# EAGLE design Adafruit TFP401 to 40pin TFT (EAGLE 7.7.0)
COMPANY: ADAFRUIT INDUSTRIES; DRAWN: FZHAO; REV: C
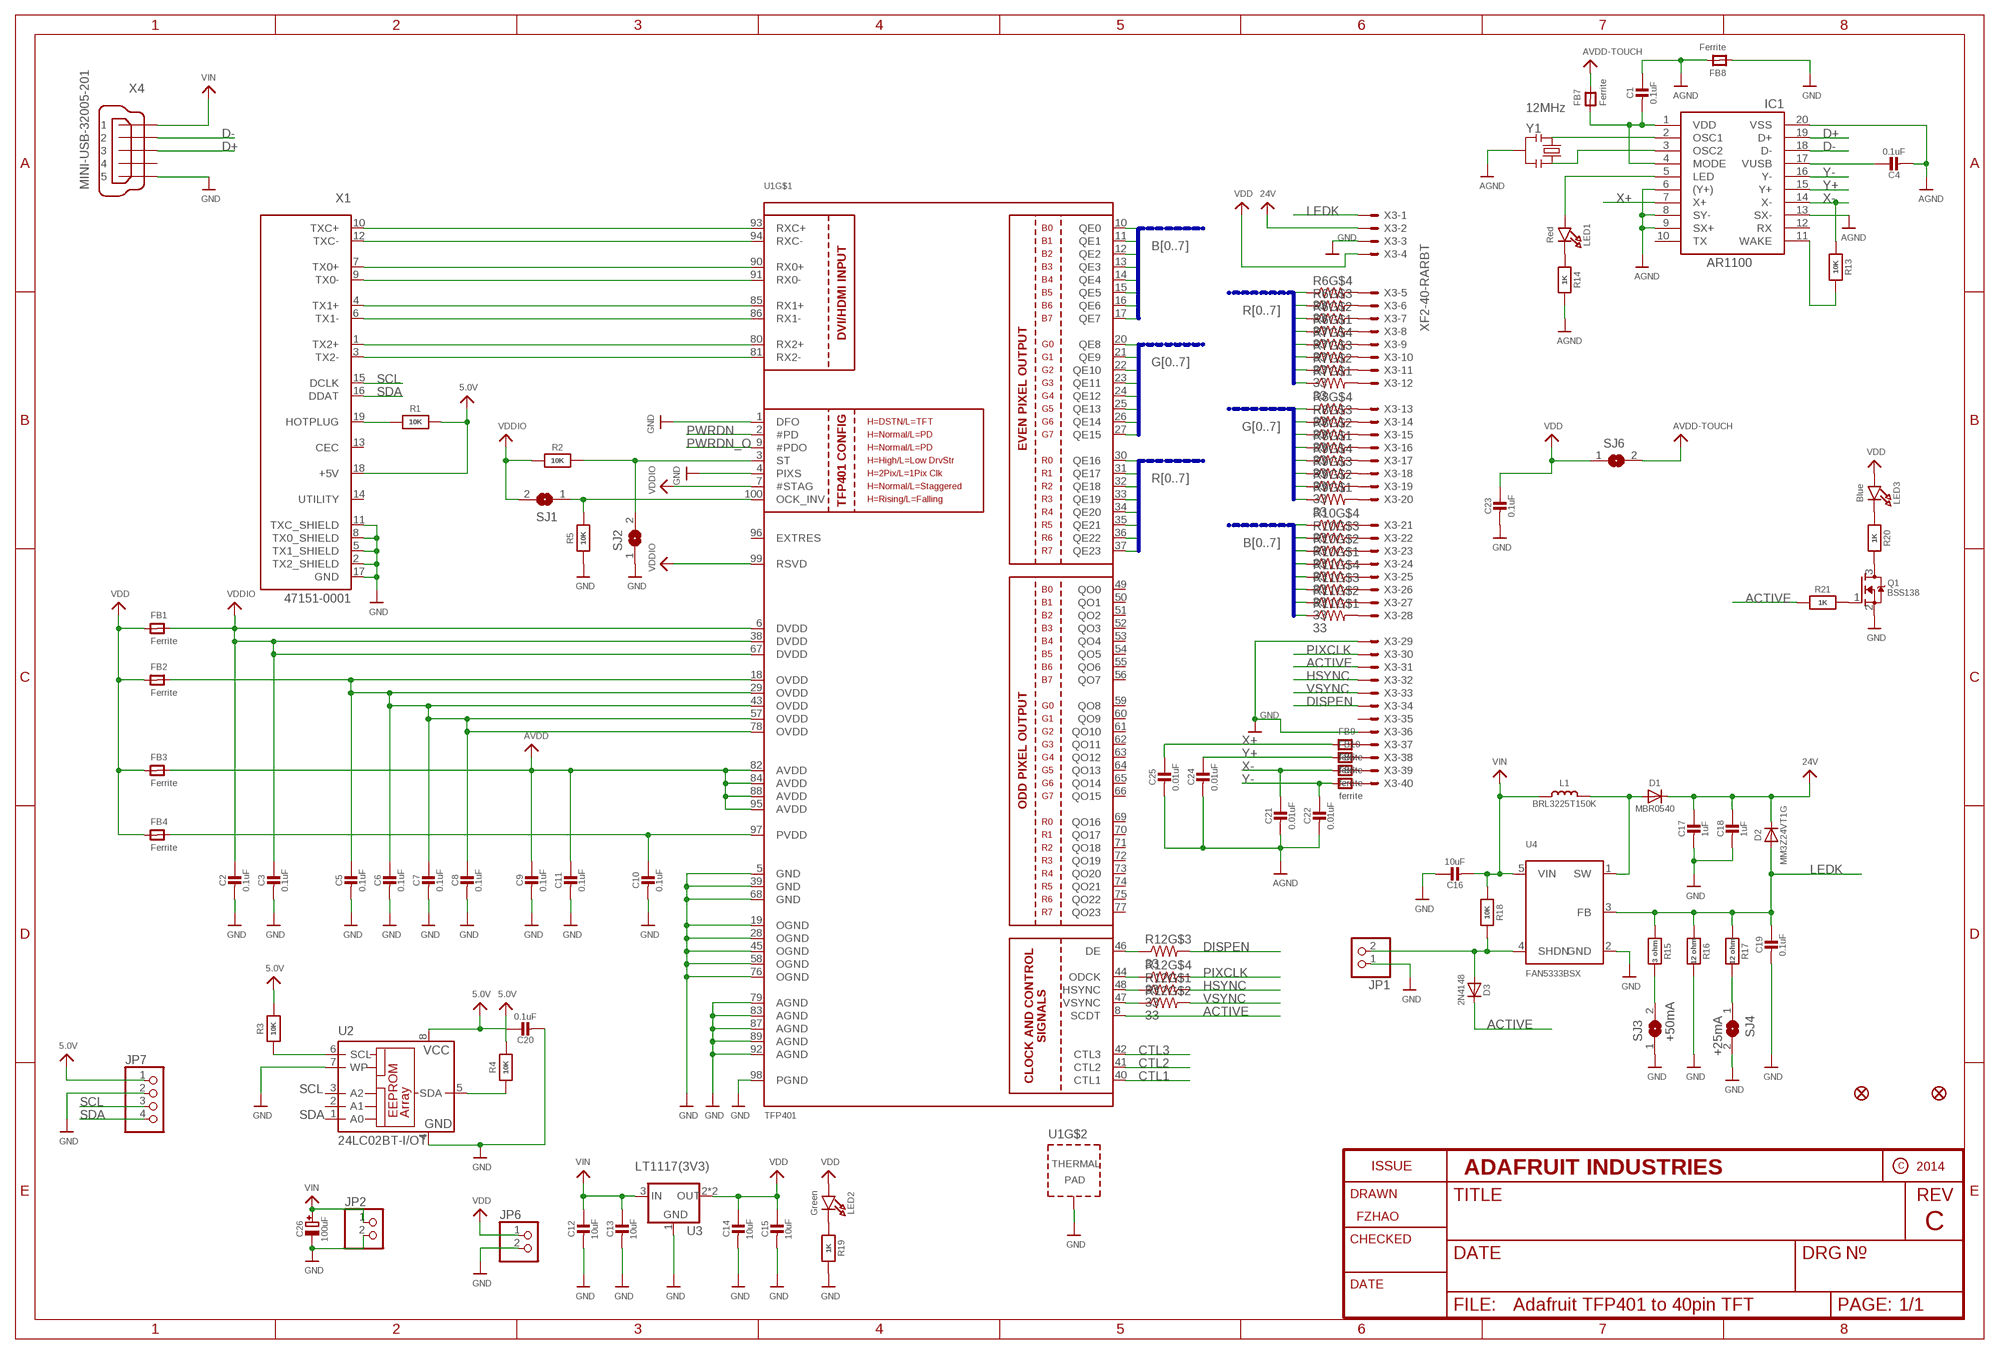
[diagram p0: schematic, sheet 1]

## Parts
C1  0.1uF  CAP_CERAMIC0805-NOOUTLINE  [0805-NO]
C2  0.1uF  CAP_CERAMIC0805-NOOUTLINE  [0805-NO]
C3  0.1uF  CAP_CERAMIC0805-NOOUTLINE  [0805-NO]
C4  0.1uF  CAP_CERAMIC0805-NOOUTLINE  [0805-NO]
C5  0.1uF  CAP_CERAMIC0805-NOOUTLINE  [0805-NO]
C6  0.1uF  CAP_CERAMIC_0805MP  [_0805MP]
C7  0.1uF  CAP_CERAMIC0805-NOOUTLINE  [0805-NO]
C8  0.1uF  CAP_CERAMIC0805-NOOUTLINE  [0805-NO]
C9  0.1uF  CAP_CERAMIC0805-NOOUTLINE  [0805-NO]
C10  0.1uF  CAP_CERAMIC0805-NOOUTLINE  [0805-NO]
C11  0.1uF  CAP_CERAMIC0805-NOOUTLINE  [0805-NO]
C12  10uF  CAP_CERAMIC0805-NOOUTLINE  [0805-NO]
C13  10uF  CAP_CERAMIC0805-NOOUTLINE  [0805-NO]
C14  10uF  CAP_CERAMIC0805-NOOUTLINE  [0805-NO]
C15  10uF  CAP_CERAMIC0805-NOOUTLINE  [0805-NO]
C16  10uF  CAP_CERAMIC0805-NOOUTLINE  [0805-NO]
C17  1uF  CAP_CERAMIC0805-NOOUTLINE  [0805-NO]
C18  1uF  CAP_CERAMIC0805-NOOUTLINE  [0805-NO]
C19  0.1uF  CAP_CERAMIC0805-NOOUTLINE  [0805-NO]
C20  0.1uF  CAP_CERAMIC0805-NOOUTLINE  [0805-NO]
C21  0.01uF  CAP_CERAMIC0805-NOOUTLINE  [0805-NO]
C22  0.01uF  CAP_CERAMIC0805-NOOUTLINE  [0805-NO]
C23  0.1uF  CAP_CERAMIC0805-NOOUTLINE  [0805-NO]
C24  0.01uF  CAP_CERAMIC0805-NOOUTLINE  [0805-NO]
C25  0.01uF  CAP_CERAMIC0805-NOOUTLINE  [0805-NO]
C26  100uF  CAP_ELECTROLYTICPANASONIC_C  [PANASONIC_C]
D1  MBR0540  DIODESOD-123  [SOD-123]
D2  MM3Z24VT1G  DIODESMA  [SMADIODE]
D3  2N4148  DIODESOD-323  [SOD-323]
FB1  Ferrite  FERRITE_0805MP  [_0805MP]
FB2  Ferrite  FERRITE_0805MP  [_0805MP]
FB3  Ferrite  FERRITE_0805MP  [_0805MP]
FB4  Ferrite  FERRITE_0805MP  [_0805MP]
FB5  ferrite  FERRITE_0805MP  [_0805MP]
FB6  ferrite  FERRITE_0805MP  [_0805MP]
FB7  Ferrite  FERRITE_0805MP  [_0805MP]
FB8  Ferrite  FERRITE_0805MP  [_0805MP]
FB9  ferrite  FERRITE_0805MP  [_0805MP]
FB10  ferrite  FERRITE_0805MP  [_0805MP]
FID1  FIDUCIAL""  [FIDUCIAL_1MM]
FID3  FIDUCIAL""  [FIDUCIAL_1MM]
IC1  AR1100_SSOP  [TSSOP20-5.3MMBODY]
JP1  HEADER-1X2ROUND  [1X02_ROUND]
JP2  HEADER-1X2ROUND  [1X02_ROUND]
JP6  HEADER-1X2ROUND  [1X02_ROUND]
JP7  HEADER-1X476MIL  [1X04_ROUND_76]
L1  BRL3225T150K  INDUCTORNR5040  [INDUCTOR_5X5MM_NR5040_NOTHERMALS]
LED1  Red  LED0805_NOOUTLINE  [CHIPLED_0805_NOOUTLINE]
LED2  Green  LED0805_NOOUTLINE  [CHIPLED_0805_NOOUTLINE]
LED3  Blue  LED0805_NOOUTLINE  [CHIPLED_0805_NOOUTLINE]
Q1  BSS138  MOSFET-NREFLOW  [SOT23-R]
R1  10K  RESISTOR0805_NOOUTLINE  [0805-NO]
R2  10K  RESISTOR0805_NOOUTLINE  [0805-NO]
R3  10K  RESISTOR0805_NOOUTLINE  [0805-NO]
R4  10K  RESISTOR0805_NOOUTLINE  [0805-NO]
R5  10K  RESISTOR_0805MP  [_0805MP]
R6  33  RESISTOR_4PACK_US  [RESPACK_4X0603]
R7  33  RESISTOR_4PACK_US  [RESPACK_4X0603]
R8  33  RESISTOR_4PACK_US  [RESPACK_4X0603]
R9  33  RESISTOR_4PACK_US  [RESPACK_4X0603]
R10  33  RESISTOR_4PACK_US  [RESPACK_4X0603]
R11  33  RESISTOR_4PACK_US  [RESPACK_4X0603]
R12  33  RESISTOR_4PACK_US  [RESPACK_4X0603]
R13  10K  RESISTOR_0805MP  [_0805MP]
R14  1K  RESISTOR0805_NOOUTLINE  [0805-NO]
R15  3 ohm  RESISTOR0805_NOOUTLINE  [0805-NO]
R16  12 ohm  RESISTOR0805_NOOUTLINE  [0805-NO]
R17  12 ohm  RESISTOR0805_NOOUTLINE  [0805-NO]
R18  10K  RESISTOR0805_NOOUTLINE  [0805-NO]
R19  1K  RESISTOR0805_NOOUTLINE  [0805-NO]
R20  1K  RESISTOR0805_NOOUTLINE  [0805-NO]
R21  1K  RESISTOR0805_NOOUTLINE  [0805-NO]
SJ1  SOLDERJUMPER  [SOLDERJUMPER_ARROW_NOPASTE]
SJ2  SOLDERJUMPER  [SOLDERJUMPER_ARROW_NOPASTE]
SJ3  +50mA  SOLDERJUMPER  [SOLDERJUMPER_ARROW_NOPASTE]
SJ4  +25mA  SOLDERJUMPER  [SOLDERJUMPER_ARROW_NOPASTE]
SJ6  SOLDERJUMPERCLOSED  [SOLDERJUMPER_CLOSEDWIRE]
U1  TFP401  [S-PQFP-G100]
U2  24LC02BT-I/OT  24C02ASM  [SO-08M]
U3  LT1117(3V3)  VREG_SOT223  [SOT223-R]
U4  FAN5333BSX  VREG_FAN5331  [SOT23-5]
X1  47151-0001  HDMI_MOLEX_47151DIM  [HDMI_MOLEX_47151-0001_DIMLAYER]
X3  XF2-40-RARBT  [4-1734839-0]
X4  MINI-USB-32005-201  [32005-201]
Y1  12MHz  RESONATORSMD  [RESONATOR-SMD]

## Nets
5.0V: C20.1 JP7.1 R1.2 R3.2 R4.2 U2.8(VCC) X1.18(+5V)
24V: C17.1 C18.1 D1.C D2.C X3.2
ACTIVE: D3.C R21.1 U1.8(SCDT) X3.31
AGND: C1.1 C4.2 C21.2 C22.2 C24.2 C25.2 FB8.2 IC1.6((Y+)) IC1.8(SY-) IC1.9(SX+) IC1.13(SX-) IC1.20(VSS) R14.2 Y1.2
ASD: R12.3 U1.46(DE)
AVDD: C9.1 C11.1 FB3.2 U1.82(AVDD) U1.84(AVDD) U1.88(AVDD) U1.95(AVDD)
AVDD2: FB7.2 SJ6.2 ; supply symbol labelled AVDD-TOUCH
B0: R10.4 U1.10(QE0)
B1: R10.3 U1.11(QE1)
B2: R10.2 U1.12(QE2)
B3: R10.1 U1.13(QE3)
B4: R11.4 U1.14(QE4)
B5: R11.3 U1.15(QE5)
B6: R11.2 U1.16(QE6)
B7: R11.1 U1.17(QE7)
CTL1: U1.40(CTL1)
CTL2: U1.41(CTL2)
CTL3: U1.42(CTL3)
CVB: R12.2 U1.47(VSYNC)
D+: IC1.19(D+) X4.3
D-: IC1.18(D-) X4.2
DISPEN: R12.6 X3.34
G0: R8.4 U1.20(QE8)
G1: R8.3 U1.21(QE9)
G2: R8.2 U1.22(QE10)
G3: R8.1 U1.23(QE11)
G4: R9.4 U1.24(QE12)
G5: R9.3 U1.25(QE13)
G6: R9.2 U1.26(QE14)
G7: R9.1 U1.27(QE15)
GND: C2.2 C3.2 C5.2 C6.2 C7.2 C8.2 C9.2 C10.2 C11.2 C12.2 C13.2 C14.2 C15.2 C16.1 C17.2 C18.2 C19.2 C20.2 C23.2 C26.- FB8.1 JP1.1 JP2.2 JP6.2 JP7.2 Q1.2(S) R5.1 R16.2 R19.2 SJ2.1 SJ3.1 SJ4.2 U1.1(DFO) U1.4(PIXS) U1.5(GND) U1.19(OGND) U1.28(OGND) U1.39(GND) U1.45(OGND) U1.58(OGND) U1.68(GND) U1.76(OGND) U1.79(AGND) U1.83(AGND) U1.87(AGND) U1.89(AGND) U1.92(AGND) U1.98(PGND) U1.P$1(TP) U1.P$2(TP) U1.P$3(TP) U1.P$4(TP) U1.P$5(TP) U1.P$6(TP) U1.P$7(TP) U1.P$8(TP) U1.P$9(TP) U1.P$10(TP) U1.P$11(TP) U1.P$12(TP) U1.P$13(TP) U1.P$14(TP) U1.P$15(TP) U1.P$16(TP) U1.THERMAL(TP) U2.4(GND) U2.7(WP) U3.1(GND) U4.2(GND) X1.2(TX2_SHIELD) X1.5(TX1_SHIELD) X1.8(TX0_SHIELD) X1.11(TXC_SHIELD) X1.17(GND) X3.3 X3.29 X3.36 X4.5
HSYNC: R12.8 X3.32
LEDK: C19.1 D2.A R15.1 R16.1 R17.1 U4.3(FB) X3.1
N$1: U1.93(RXC+) X1.10(TXC+)
N$2: U1.94(RXC-) X1.12(TXC-)
N$3: U1.90(RX0+) X1.7(TX0+)
N$4: U1.91(RX0-) X1.9(TX0-)
N$5: U1.85(RX1+) X1.4(TX1+)
N$6: U1.86(RX1-) X1.6(TX1-)
N$7: U1.80(RX2+) X1.1(TX2+)
N$8: U1.81(RX2-) X1.3(TX2-)
N$9: R1.1 X1.19(HOTPLUG)
N$10: IC1.2(OSC1) Y1.1
N$11: IC1.3(OSC2) Y1.3
N$12: C4.1 IC1.17(VUSB)
N$13: LED2.C R19.1
N$14: R6.5 X3.5
N$15: R6.6 X3.6
N$16: R6.7 X3.7
N$17: R6.8 X3.8
N$18: R7.5 X3.9
N$19: R7.6 X3.10
N$20: R7.7 X3.11
N$21: R7.8 X3.12
N$22: R8.5 X3.13
N$23: R8.6 X3.14
N$24: R8.7 X3.15
N$25: R8.8 X3.16
N$26: R9.5 X3.17
N$27: R9.6 X3.18
N$28: R9.7 X3.19
N$29: R9.8 X3.20
N$30: R10.5 X3.21
N$31: R10.6 X3.22
N$32: R10.7 X3.23
N$33: R10.8 X3.24
N$34: R11.5 X3.25
N$35: R11.6 X3.26
N$36: R11.7 X3.27
N$38: C10.1 FB4.2 U1.97(PVDD)
N$39: R11.8 X3.28
N$40: IC1.11(WAKE) R13.2
N$41: LED1.C R14.1
N$42: C5.1 C6.1 C7.1 C8.1 FB2.2 U1.18(OVDD) U1.29(OVDD) U1.43(OVDD) U1.57(OVDD) U1.78(OVDD)
N$43: IC1.5(LED) LED1.A
N$45: LED3.C R20.1
N$46: Q1.3(D) R20.2
N$47: D1.A L1.P$2 U4.1(SW)
N$48: Q1.1(G) R21.2
N$49: R15.2 SJ3.2
N$50: R17.2 SJ4.1
N$52: D3.A JP1.2 R18.2 U4.4(SHDN)
N$53: FB5.2 X3.39
N$54: FB6.2 X3.40
N$55: C1.2 FB7.1 IC1.1(VDD) IC1.4(MODE)
N$56: FB9.2 X3.37
N$57: FB10.2 X3.38
OCK_INV: R5.2 SJ1.1 U1.100(OCK_INV)
PIXCLK: R12.5 X3.30
PWRDN: U1.2(#PD)
PWRDN_O: U1.9(#PDO)
R0: R6.4 U1.30(QE16)
R1: R6.3 U1.31(QE17)
R2: R6.2 U1.32(QE18)
R3: R6.1 U1.33(QE19)
R4: R7.4 U1.34(QE20)
R5: R7.3 U1.35(QE21)
R6: R7.2 U1.36(QE22)
R7: R7.1 U1.37(QE23)
SCL: JP7.3 R3.1 U2.6(SCL) X1.15(DCLK)
SDA: JP7.4 R4.1 U2.5(SDA) X1.16(DDAT)
ST: R2.2 SJ2.2 U1.3(ST)
VDD: C14.1 C15.1 C23.1 FB1.1 FB2.1 FB3.1 FB4.1 JP6.1 LED2.A LED3.A SJ6.1 U3.2(OUT) U3.4(OUT) X3.4
VDDIO: C2.1 C3.1 FB1.2 R2.1 SJ1.2 U1.6(DVDD) U1.7(#STAG) U1.38(DVDD) U1.67(DVDD) U1.99(RSVD)
VIN: C12.1 C13.1 C16.2 C26.+ JP2.1 L1.P$1 R18.1 U3.3(IN) U4.5(VIN) X4.1
VSYNC: R12.7 X3.33
X+: C25.1 FB9.1 IC1.7(X+)
X-: C21.1 FB5.1 IC1.14(X-) R13.1
XCV: R12.1 U1.48(HSYNC)
Y+: C24.1 FB10.1 IC1.15(Y+)
Y-: C22.1 FB6.1 IC1.16(Y-)
ZXC: R12.4 U1.44(ODCK)
Unconnected: IC1.10(TX) IC1.12(RX) U1.49(QO0) U1.50(QO1) U1.51(QO2) U1.52(QO3) U1.53(QO4) U1.54(QO5) U1.55(QO6) U1.56(QO7) U1.59(QO8) U1.60(QO9) U1.61(QO10) U1.62(QO11) U1.63(QO12) U1.64(QO13) U1.65(QO14) U1.66(QO15) U1.69(QO16) U1.70(QO17) U1.71(QO18) U1.72(QO19) U1.73(QO20) U1.74(QO21) U1.75(QO22) U1.77(QO23) U1.96(EXTRES) U2.1(A0) U2.2(A1) U2.3(A2) X1.13(CEC) X1.14(UTILITY) X3.35 X4.4

## Buses
B[0..7]
G[0..7]
R[0..7]

## Power pins joined to a net without a drawn wire
GND: X1.P$1(GND) X1.P$2(GND) X1.P$3(GND) X1.P$4(GND)

## Library data of the parts
C1-C25 = microbuilder:CAP_CERAMIC: Ceramic Capacitors For new designs, use the packages preceded by an '_' character since they are more reliable: The following footprints should be used on most boards: _0402 - Standard footprint for regular board layouts _0603 - Standard footprint for regular board layouts _0805 - Standard footprint for regular board layouts _1206 - Standard footprint for regular board layouts For extremely tight-pitch boards where space is at a premium, the following 'micro-pitch' footprints can be used (smaller pads, no silkscreen outline, etc.): _0402MP - Micro-pitch footprint for very dense/compact boards _0603MP - Micro-pitch footprint for very dense/compact boards _0805MP - Micro-pitch footprint for very dense/compact boards _1206MP - Micro-pitch footprint for very dense/compact boards
C26 = microbuilder:CAP_ELECTROLYTIC: Electrolytic Capacitors SMT PANASONIC_C - Size C Panasonic Electrolytic Aluminum Capacitor 47µF 16V 20% Electrolytic Capacitor [Digikey: PCE3890TR-ND] PANASONIC_D - Size D Panasonic Electrolytic Aluminum Capacitor 100µF 25V 20% Electrolytic Capacitor [Digikey: PCE3898TR-ND] PTH 3.5 mm grid, 8 mm diameter ... 3.5 mm grid, 10 mm diameter ...
D1-D3 = microbuilder:DIODE: Diode SMA Model Volts Amps Type Vf Ir Digikey # Notes SSA34-E3 40V 3A Schottky 480mV @ 3A 200uA @ 40V SSA34-E3/61TGITR-ND CDBA120-G 20V 1A Schottky 500mV @ 1A 500uA @ 20V 641-1014-6-ND REEL MBRA210 10V 2A Schottky 350mV @ 2A 700uA @ 10V MBRA210LT3 SOD-123 Model Volts Amps Type Vf Ir Order # Notes BAT54T1G 30V 200mA Schottky 800mV @ 200mA 2uA @ 25V BAT54T1GOSTR-ND B0530W 30V 500mA Schottky 430mV @ 500mA 130uA @ 30V B0530W-FDICT-ND REEL MBR120 20V 1A Schottky 340mV @ 1A MBR120VLSFT1GOSCT-ND SOD-323 Model Volts Amps Type Vf Ir Order # Notes PMEG2005EJ 20V 500mA Schottky 355mV @ 500mA 568-4110-1-ND ZLLS410 10V 570mA Schottky 380mV @ 570mA ZLLS410CT-ND 1N4148WS 75V 150mA Silicon/Simple 1V 1N4148WSFSCT-ND REEL SOD-523 Model Volts Amps Type Vf Ir Order # Notes BAT54XV2 30V 200mA Schottky 0.8V @ 100mA BAT54XV2CT-ND TB751S 30V 30mA Schottky RB751S-40TE61CT-ND SOT23-R/W (R = Solder Paste/Reflow Ovens, W = Hand-Soldering) Model Volts Amps Type Vf Ir Order # Notes BAT54FILM 40V 300mA Schottky 497-7162-1-ND POWERDI-5 Model Volts Amps Type Vf Ir Order # Notes PDS560 60V 5A Schottky 670mV @ 5A 150uA @ 60V PDS560DICT-ND
FB1-FB10 = microbuilder:FERRITE: Ferrite Bead 0603 MMZ1608B121C - 120 Ohm @ 100MHz, 600mA, 0.15 Ohm DC Resistance - Digikey: 445-2164-1-ND BK1608HW121-T - 120 Ohm, 600mA Ferrite Chip - Digikey: 587-1876-2-ND 0805 HZ0805B272R-10 - 2.7K Ohm @ 100MHz, 200mA, 0.8 Ohm DC Resistance - Digikey: 240-2504-1-ND (see also Murata BLM21BD272SN1L) MMZ2012Y152B - 1.5K Ohm @ 100MHz, 500mA, 0.4 Ohm DC Resistance - Digikey: 445-1560-1-ND - Mainly for high frequency (80-400MHz) MMZ2012R102A - 1K Ohm @ 100MHz, 500mA, 0.3 Ohm DC Resistance - Digikey: 445-1555-2-ND - More general purpose (10-200MHz)
FID1 FID3 = microbuilder:FIDUCIAL: Fiducial Alignment Points Various fiducial points for machine vision alignment.; BOM: EXCLUDE
IC1 = microbuilder:AR1100
JP1 JP2 JP6 = microbuilder:HEADER-1X2: PIN HEADER
JP7 = microbuilder:HEADER-1X4: PIN HEADER
L1 = microbuilder:INDUCTOR: Inductors 0603: 10nH Ceramic Inductor - microwire antenna/RF (Digikey: 712-1434-2-ND) 0805: 560nH Ceramic Inductor - RF (Digikey: 553-1047-1-ND) 270nH Ceramic Inductor - Q = 40@250MHz, +-5%, 1 Ohm DC Resistance (Digikey: 535-10506-2-ND) 1007 (2518 Metric) SMT: 10µH 10% 250mOhm 820mA 1007 Inductor (Digikey: 587-2189-1-ND) 22µH 10% 500mOhm 580mA 1007 Inductor (Digikey: 587-2190-1-ND) 47µH 10% 950mOhm 420mA 1007 Inductor (Digikey: 587-2191-1-ND) 47µH 5% 100mOhm 1A 1008 Inductor (Digikey: 732-1816-1-ND) 5.0x5.0mm (Taiyo Yuden NR5040 Series) 6.8µH 20% 2.3A 64mOhm Inductor (Digikey: 587-2374-2-ND) 5.0x5.0mm (TDK VLC5045 Series) 4.7µH 20% 3.3A 34mOhm Inductor (Digikey: 445-6526-1-ND) 6.8µH 20% 2.7A 46mOhm Inductor (Digikey: 445-6527-1-ND) 6.0x6.0mm (TDK VLC6045 Series) 4.7µH 20% 3.8A 27mOhm Inductor (Digikey: 445-6538-2-ND) 6.8µH 20% 3A 41mOhm Inductor (Digikey: 445-6540-1-ND) 6.2µH 30% 2.2A 45mOhm Inductor (Digikey: SRR5028-6R2YCT-ND) - Not TDK VLC6045 but footprint should match 6.0x6.0mm (TDK SLF6045 Series) 6.8uH 30% 2A 33mOhm Inductor (Digikey: 445-4572-1-ND, Mouser: 810-SLF645T6R8N2R0PF) 6.0x6.0mm (Sumida CDRH5D28 Series) 6.2uH 30% 1.8A 45mOhm Inductor (Digikey: 308-1542-1-ND) Taiyo Yuden NR3015T2R2M - 2.2uH 20% 1.5A (Digikey: 587-1648-2-ND, Mouser: 963-NR3015T2R2M) - Used with TI TPS62172 CoilCraft RFID Transponder Coil - MA5532-AE (For use with AS3935 Lightning Sensor) Vishay IHLP 1.0uH Molded Inductor - 24mOhm DCR, 5A, +/-20%, -55°C-125°C (Digikey: 541-1319-1-ND)
LED1-LED3 = microbuilder:LED: LED 0603 - 0603 Surface Mount Package 2mA: Green LED - Low Power (3.9mcd, 2ma, 1.7Vf) - Digikey: 475-2709-2-ND Orange LED - Low Power (9.8mcd, 2ma, 1.8Vf) - Digikey: 475-1194-2-ND Red LED - Low Power (5mcd, 2ma, 1.8Vf) - Digikey: 475-1195-2-ND Yellow LED - Low Power (7mcd, 2ma, 1.8Vf) - Digikey: 475-1196-2-ND 5mA: Blue LED - Low Power (17mcd, 5ma, 2.9Vf) - Digikey: LNJ937W8CRACT-ND 0805 - 0805 Surface Mount Package 2mA: Red LED (8.8mcd, 2mA, 1.8Vf, Clear) - Low Power [Digikey: 475-2510-1-ND] Green LED (5mcd, 2mA, 1.8Vf, Clear) - Low Power [Digikey: 475-2730-1-ND] Yellow LED (11.3mcd, 2mA, 1.8Vf, Clear) - Low Power [Digikey: 475-2555-1-ND] 20mA: Red LED (104mcd, 20mA, Diffused) - LS R976 [Digikey: 475-1278-6-ND] Red LED (12mcd, 20mA, 2.0Vf, Clear) - APT2012EC [Digikey: 754-1128-1-ND] Green LED (15mcd, 20mA, 2.2Vf, Clear) - APT2012GC [Digikey: 754-1131-1-ND] Orange LED (160mcd, 20mA, 2.1Vf, Clear) - APT2012SECK [Digikey: 754-1130-1-ND] 1206 - 1206 Surface Mount Package Green LED (26mcd, 20mA, Diffused) - LG N971 [Digikey: 475-1407-6-ND] Red LED (15mcd, 20mA, Diffused) - LH N974 [Digikey: 475-1416-6-ND] Cree - Cree High-Power Surface Mount LEDs XPEBWT-L1-0000-00D50 - White 111lm 350mA 2.9Vf 6200K 110° XTEAWT-00-0000-00000LEE3 - White 114lm 350mA 2.85Vf 5000K 115° Everlight - Everlight 45-21 Series Surface Mount LEDs 45-21/QK2C-B2832AC2CB2/2T - Warm White 2000mcd 20mA 3.25Vf 3050K 120° 45-21/LK2C-B38452C4CB2/2T - Nuetral White 2000mcd 20mA 3.25Vf 4150K 120° 45-21/LK2C-B50634C6CB2/2T - Cold White 2200mcd 20mA 3.25Vf 5650K 120° PLCC2 Reverse Mount LS T77K-J1L2-1-0-2-R18-Z - Red 11.25mcd 2mA 1.8Vf 630nm 120° LO T77K-L1M2-24-Z - Orange 19.6mcd 2mA 1.8Vf 606nm 120° LY T77K-K2M1-26-Z - Yellow 15.7mcd 2mA 1.8Vf 587nm 120°
Q1 = microbuilder:MOSFET-N: N-Channel Mosfet LEGEND VDS: Voltage Drain-Source ID: Drain Current RDS(ON): Drain-Source On-State Resistance VGS(TH): Gate-Source Threshold Voltage CISS: Drain-Source Input Capacitance SOT-23 Name VDS ID RDS(ON) VGS(TH) CISS Order Number 2N7002E 60V 260mA 2.5 Ohm 2.5V @ 250uA 26.7pF @ 25V 2N7002ET1GOSTR-ND BSH103 30V 850mA 400 mOhm 400mV @ 1mA 83pF @ 24V BSH103,235-ND BSS138 60V 320mA 1.6 Ohm 1.5V @ 250uA 50pF @ 10V Mouser: 771-BSS138PW115 DMN2075U-7 20V 4.2A 38 mOhm 1V @ 250 uA 594.3pF @ 10V DMN2075U-7DICT-ND * BSS138 good choice for I2C level-shifting POWERPAK 1212-8 Name VDS ID RDS(ON) VGS(TH) CISS Order Number Si7308DN 60V 6A 58 mOhm 3V @ 250uA 665pF @ 15V SI7308DN-T1-E3CT-ND
R1-R5 R13-R21 = microbuilder:RESISTOR: Resistors For new designs, use the packages preceded by an '_' character since they are more reliable: The following footprints should be used on most boards: _0402 - Standard footprint for regular board layouts _0603 - Standard footprint for regular board layouts _0805 - Standard footprint for regular board layouts _1206 - Standard footprint for regular board layouts For extremely tight-pitch boards where space is at a premium, the following 'micro-pitch' footprints can be used (smaller pads, no silkscreen outline, etc.): _0402MP - Micro-pitch footprint for very dense/compact boards _0603MP - Micro-pitch footprint for very dense/compact boards _0805MP - Micro-pitch footprint for very dense/compact boards _1206MP - Micro-pitch footprint for very dense/compact boards
R6-R12 = microbuilder:RESISTOR_4PACK_US: Resistor Packs (4 resistors) 4 x 0603 10K 1/16W - Digikey: YC164J-10KCT-ND
SJ1-SJ4 = microbuilder:SOLDERJUMPER: SMD Solder JUMPER Solder the two pads together to create a connection, or remove the solder to break it. REFLOW - Use this footprint for solder paste and reflow ovens. WAVE - Use this footprint for hand-soldering (larger pads). CLOSED - Has a trace between the two pads to ensure it is closed by default. The trace needs to be cut to disable the jumper, and can be closed again by creating a solder bridge between the two pads.; BOM: EXCLUDE
SJ6 = microbuilder:SOLDERJUMPER: SMD Solder JUMPER Solder the two pads together to create a connection, or remove the solder to break it. REFLOW - Use this footprint for solder paste and reflow ovens. WAVE - Use this footprint for hand-soldering (larger pads). CLOSED - Has a trace between the two pads to ensure it is closed by default. The trace needs to be cut to disable the jumper, and can be closed again by creating a solder bridge between the two pads.
U1 = microbuilder:TFP401: TFP401 PanelBus Digital Receiver Supports Pixel Rates Up to 165 MHz (Including 1080p and WUXGA at 60Hz) Supply Voltage: 3.0-3.6V Operating Temperature: 0-70°C (EP version exists with -55-125°C)
U2 = microchip:24*: Serial EEPROM I2C; MF: MICROCHIP; MPN: 24C02C/SN; OC_FARNELL: 1084339; OC_NEWARK: 96K4065
U3 = microbuilder:VREG_SOT223: SOT-223 Fixed Voltage Regulators Part Current Out V Out V In V Dropout θJA (°C/W) TJ (°C) Operating Temp Digikey Part No. AP1117 1A 3.3V 18V 1.1V@500mA, 1.3V@1A 107°C/W 150°C -40°C-125°C AP1117IE33G-13DICT-ND Max operating temp can be calculated using θJA, TJ (max junction temperature), and power in watts. Set the "Maximum Ambient Temperature" until it reaches TJ ("Max Junction Temperature"), which is the absolute limit for safe use of the regulator: Heat Sink Temperature Calculator <http://www.daycounter.com/Calculators/Heat-Sink-Temperature-Calculator.phtml> For example, With 12V source into a 3.3V LP2985 and a 30mA load, we are dissipating (12V-3.3V) * 0.03A = 0.261W. With a θJA of 206 °C/W, a TJ of 150°C, and 261mW we can safely use the chip without a heat sink up to 75°C (=147.1°C Junction Temperature).
U4 = microbuilder:VREG_FAN5331: FAN5331 - LED/OLED 20V Boost Converter Digikey: FAN5331SXCT-ND
X1 = microbuilder:HDMI_MOLEX_47151: The default footprint uses layer 46 (Milling) for the tabs, the DIMLAYER footprint uses layer 20 (Dimensions). Both will probably require special instructions to the board house
X3 = adafruit:XF2*-40?: OMRON FPC Connector Source : http://www.omron.com/ecb/products/pdf/fpc.pdf XF2M-4015-rev is good for connecting up 'PSP' SHARP LQ043 LCDs
X4 = con-cypressindustries:MINI-USB-: MINI USB-B Conector Source: www.cypressindustries.com; OC_FARNELL: unknown; OC_NEWARK: unknown
Y1 = SparkFun:RESONATOR: Resonator Small SMD resonator. This is the itty bitty 10/20MHz resonators with built in caps. CSTCE10M0G55 and CSTCE20M0V53. Footprint has been reviewed closely but hasn't been tested yet.

## Board
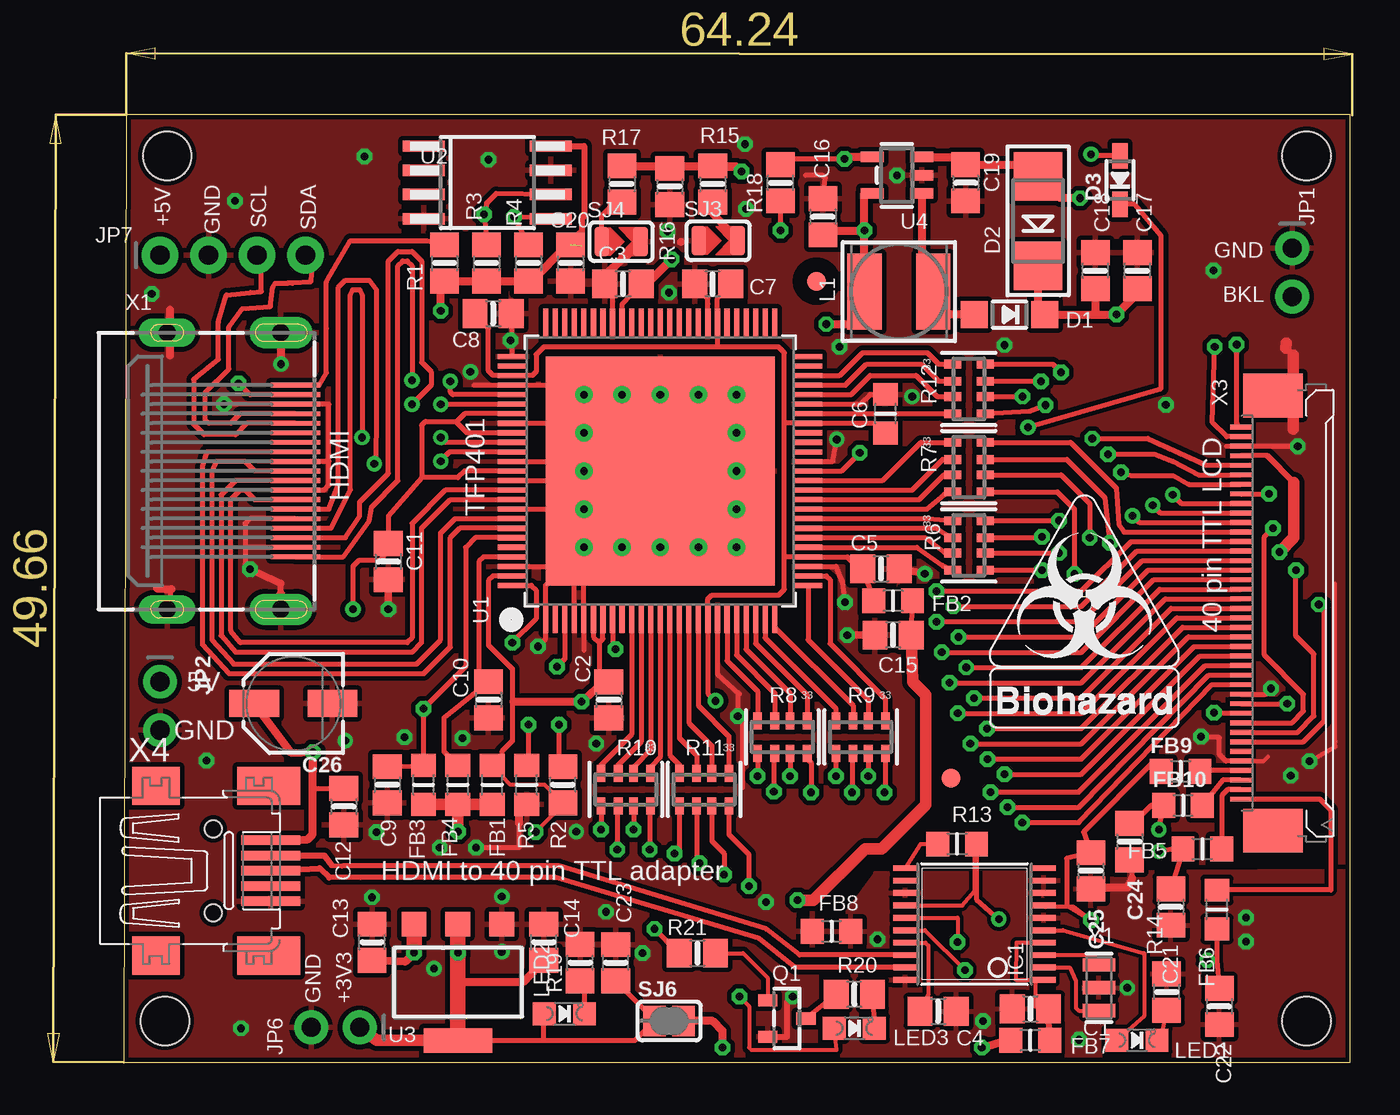
[diagram p1: board, top side]
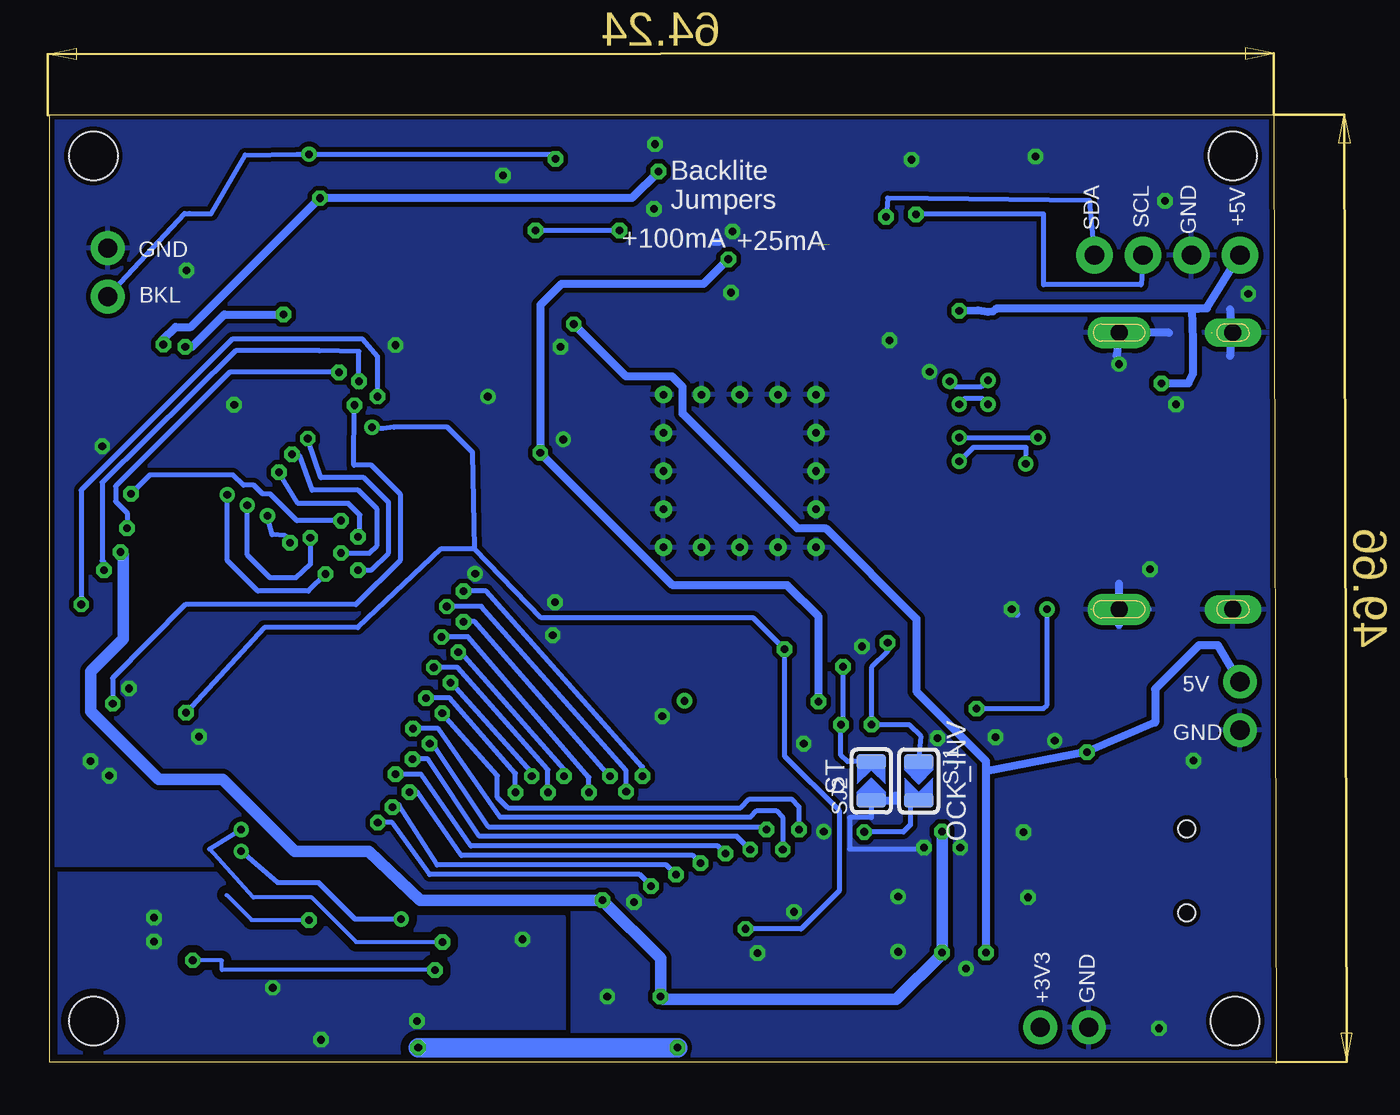
[diagram p2: board, bottom side, seen from below]

Size 64.26 x 49.66 mm. Coordinates in mm from the lower left corner, seen from the top.
Outline: 0.13,49.66 0,0 64.26,0 64.26,49.66 0.13,49.66
Copper layers (1*16): Top 0.035mm / dielectric 1.5mm / Bottom 0.035mm
Design rules "adafruit": minimum track width 8mil, minimum drill 15.5mil, track to track 8mil, track to pad 8mil, pad to pad 8mil, via to via 8mil, smd to smd 8mil, copper to edge 10mil, drill to drill 8mil, minimum pad ring 10mil, minimum via ring 8mil, stop-mask expansion 2mil, vias tented up to drill 20mil, thermal gap 10mil
tRestrict: area 23.8,23.1 to 23.9,23.4; area 6.1,18.9 to 6.6,19; area 21.2,33.8 to 22,35.2; area 21.3,31.8 to 22,33.1; area 21.3,30.7 to 21.8,31.2; area 21.3,29.2 to 22,30.1; area 21.5,26.3 to 21.8,28.7; area 22.4,24.3 to 23.4,24.9; area 24.4,24.3 to 30.2,24.8; area 48.4,8.8 to 48.8,8.9; 1 lines

### Footprints (pad centres in the part's own frame; a part is rotated, then mirrored left to right if it is on the bottom)
0805-NO = smd 1.3 x 1.5: 1 -0.95,0; 2 0.95,0
_0805MP = smd 1.2 x 1.3: 1 -1.016,0; 2 1.016,0
PANASONIC_C = smd 2.6 x 1.4: + 2.05,0; - -2.05,0
SOD-123 = smd 1.4 x 1.4: A 1.85,0; C -1.85,0
SMADIODE = smd 2.54 x 2.54: A 2.349,0; C -2.349,0
SOD-323 = smd 1.35 x 0.8: A 1.27,0; C -1.27,0
FIDUCIAL_1MM = smd 1 x 1: 1 0,0
TSSOP20-5.3MMBODY = smd 0.305 x 1.27: 1 -2.925,-3.618; 2 -2.275,-3.618; 3 -1.625,-3.618; 4 -0.975,-3.618; 5 -0.325,-3.618; 6 0.325,-3.618; 7 0.975,-3.618; 8 1.625,-3.618; 9 2.275,-3.618; 10 2.925,-3.618; 11 2.925,3.618; 12 2.275,3.618; 13 1.625,3.618; 14 0.975,3.618; 15 0.325,3.618; 16 -0.325,3.618; 17 -0.975,3.618; 18 -1.625,3.618; 19 -2.275,3.618; 20 -2.925,3.618
1X02_ROUND = drill 1 pad 1.778: 1 -1.27,0; 2 1.27,0
1X04_ROUND_76 = drill 1 pad 1.93: 1 -3.81,0; 2 -1.27,0; 3 1.27,0; 4 3.81,0
INDUCTOR_5X5MM_NR5040_NOTHERMALS = smd 1.8 x 4: P$1 -1.8,0; P$2 1.8,0
CHIPLED_0805_NOOUTLINE = smd 1.2 x 1.2: A 0,-1.05; C 0,1.05
SOT23-R = smd 0.635 x 1.016: 1 -0.95,-1; 2 0.95,-1; 3 0,1
RESPACK_4X0603 = smd 0.45 x 0.9: 1 -1.3,-0.85; 2 -0.4,-0.85; 3 0.4,-0.85; 4 1.3,-0.85; 5 1.3,0.85; 6 0.4,0.85; 7 -0.4,0.85; 8 -1.3,0.85
SOLDERJUMPER_ARROW_NOPASTE = smd 0.762 x 1.524: 1 -1.016,0; 2 1.016,0
SOLDERJUMPER_CLOSEDWIRE = smd 1.168 x 1.6: 1 -0.762,0; 2 0.762,0 | smd 0.635 x 0.203: WIRE 0,0
S-PQFP-G100 = smd 0.27 x 1.5: 1 -6,-7.75; 2 -5.5,-7.75; 3 -5,-7.75; 4 -4.5,-7.75; 5 -4,-7.75; 6 -3.5,-7.75; 7 -3,-7.75; 8 -2.5,-7.75; 9 -2,-7.75; 10 -1.5,-7.75; 11 -1,-7.75; 12 -0.5,-7.75; 13 0,-7.75; 14 0.5,-7.75; 15 1,-7.75; 16 1.5,-7.75; 17 2,-7.75; 18 2.5,-7.75; 19 3,-7.75; 20 3.5,-7.75; 21 4,-7.75; 22 4.5,-7.75; 23 5,-7.75; 24 5.5,-7.75; 25 6,-7.75; 51 6,7.75; 52 5.5,7.75; 53 5,7.75; 54 4.5,7.75; 55 4,7.75; 56 3.5,7.75; 57 3,7.75; 58 2.5,7.75; 59 2,7.75; 60 1.5,7.75; 61 1,7.75; 62 0.5,7.75; 63 0,7.75; 64 -0.5,7.75; 65 -1,7.75; 66 -1.5,7.75; 67 -2,7.75; 68 -2.5,7.75; 69 -3,7.75; 70 -3.5,7.75; 71 -4,7.75; 72 -4.5,7.75; 73 -5,7.75; 74 -5.5,7.75; 75 -6,7.75 | smd 1.5 x 0.27: 26 7.75,-6; 27 7.75,-5.5; 28 7.75,-5; 29 7.75,-4.5; 30 7.75,-4; 31 7.75,-3.5; 32 7.75,-3; 33 7.75,-2.5; 34 7.75,-2; 35 7.75,-1.5; 36 7.75,-1; 37 7.75,-0.5; 38 7.75,0; 39 7.75,0.5; 40 7.75,1; 41 7.75,1.5; 42 7.75,2; 43 7.75,2.5; 44 7.75,3; 45 7.75,3.5; 46 7.75,4; 47 7.75,4.5; 48 7.75,5; 49 7.75,5.5; 50 7.75,6; 76 -7.75,6; 77 -7.75,5.5; 78 -7.75,5; 79 -7.75,4.5; 80 -7.75,4; 81 -7.75,3.5; 82 -7.75,3; 83 -7.75,2.5; 84 -7.75,2; 85 -7.75,1.5; 86 -7.75,1; 87 -7.75,0.5; 88 -7.75,0; 89 -7.75,-0.5; 90 -7.75,-1; 91 -7.75,-1.5; 92 -7.75,-2; 93 -7.75,-2.5; 94 -7.75,-3; 95 -7.75,-3.5; 96 -7.75,-4; 97 -7.75,-4.5; 98 -7.75,-5; 99 -7.75,-5.5; 100 -7.75,-6 | drill 0.4: P$1 -4,4; P$2 -2,4; P$3 0,4; P$4 2,4; P$5 4,4; P$6 4,2; P$7 4,0; P$8 4,-2; P$9 4,-4; P$10 2,-4; P$11 0,-4; P$12 -2,-4; P$13 -4,-4; P$14 -4,-2; P$15 -4,0; P$16 -4,2 | smd 12 x 12: THERMAL 0,0
SO-08M = smd 0.6 x 2.2: 1 -1.905,-3.33; 2 -0.635,-3.33; 3 0.635,-3.33; 4 1.905,-3.33; 5 1.905,3.33; 6 0.635,3.33; 7 -0.635,3.33; 8 -1.905,3.33
SOT223-R = smd 1.3 x 1.3: 1 -2.3,-3.05; 2 0,-3.05; 3 2.3,-3.05 | smd 3.6 x 1.3: 4 0,3.05
SOT23-5 = smd 0.55 x 1.2: 1 -0.95,-1.3; 2 0,-1.3; 3 0.95,-1.3; 4 0.95,1.3; 5 -0.95,1.3
DRILL_0.1000 = hole 2.54: 0,0
HDMI_MOLEX_47151-0001_DIMLAYER = smd 0.25 x 2.6: 1 4.5,0; 2 4,0; 3 3.5,0; 4 3,0; 5 2.5,0; 6 2,0; 7 1.5,0; 8 1,0; 9 0.5,0; 10 0,0; 11 -0.5,0; 12 -1,0; 13 -1.5,0; 14 -2,0; 15 -2.5,0; 16 -3,0; 17 -3.5,0; 18 -4,0; 19 -4.5,0 | drill 0.9 pad 1.65 long: P$1 -7.25,-0.76; P$2 7.25,-0.76 | drill 0.9 pad 1.5 long: P$3 7.25,-6.72; P$4 -7.25,-6.72
4-1734839-0 = smd 0.25 x 1.1: 1 -9.75,-2.54; 2 -9.25,-2.54; 3 -8.75,-2.54; 4 -8.25,-2.54; 5 -7.75,-2.54; 6 -7.25,-2.54; 7 -6.75,-2.54; 8 -6.25,-2.54; 9 -5.75,-2.54; 10 -5.25,-2.54; 11 -4.75,-2.54; 12 -4.25,-2.54; 13 -3.75,-2.54; 14 -3.25,-2.54; 15 -2.75,-2.54; 16 -2.25,-2.54; 17 -1.75,-2.54; 18 -1.25,-2.54; 19 -0.75,-2.54; 20 -0.25,-2.54; 21 0.25,-2.54; 22 0.75,-2.54; 23 1.25,-2.54; 24 1.75,-2.54; 25 2.25,-2.54; 26 2.75,-2.54; 27 3.25,-2.54; 28 3.75,-2.54; 29 4.25,-2.54; 30 4.75,-2.54; 31 5.25,-2.54; 32 5.75,-2.54; 33 6.25,-2.54; 34 6.75,-2.54; 35 7.25,-2.54; 36 7.75,-2.54; 37 8.25,-2.54; 38 8.75,-2.54; 39 9.25,-2.54; 40 9.75,-2.54 | smd 2.3 x 3.1: M1 11.4,-0.84; M2 -11.4,-0.84
32005-201 = smd 3.1 x 0.5: 1 3,1.6; 2 3,0.8; 3 3,0; 4 3,-0.8; 5 3,-1.6 | smd 2.5 x 2: M1 -3,-4.45; M2 -3,4.45 | smd 3.3 x 2: M3 2.9,4.45; M4 2.9,-4.45 | hole 0.9: 0,2.2; 0,-2.2
RESONATOR-SMD = smd 0.7 x 1.7: 1 -1.2,0; 2 0,0; 3 1.2,0

### Placement (x,y rotation side)
C1  47.5,2.79 0 top
C2  25.41,18.98 270 top
C3  26.16,40.78 180 top
C4  42.67,2.67 0 top
C5  39.68,25.86 0 top
C6  39.91,33.98 90 top
C7  30.86,40.78 180 top
C8  19.36,39.23 0 top
C9  13.81,14.53 270 top
C10  19.11,18.99 270 top
C11  13.87,26.23 270 top
C12  11.53,13.39 270 top
C13  13.01,6.28 90 top
C14  22.01,6.28 90 top
C15  40.31,22.38 180 top
C16  36.63,44.31 270 top
C17  53.11,41.48 90 top
C18  50.91,41.48 90 top
C19  44.11,46.08 270 top
C20  23.41,41.88 270 top
C21  54.86,8.13 270 top
C22  57.4,2.92 270 top
C23  25.78,5.21 90 top
C24  52.7,11.56 270 top
C25  50.67,10.03 270 top
C26  8.89,18.8 180 top
D1  46.41,39.18 180 top
D2  47.91,44.08 90 top
D3  52.2,46.23 90 top
FB1  19.31,14.53 90 top
FB2  40.31,24.18 180 top
FB3  15.71,14.53 90 top
FB4  17.51,14.53 90 top
FB5  56.52,11.18 0 top
FB6  57.28,8 90 top
FB7  47.5,1.14 180 top
FB8  37.08,6.86 0 top
FB9  55.37,15.24 0 top
FB10  55.5,13.46 0 top
FID1  36.3,40.93 0 top
FID3  43.33,14.89 0 top
IC1  44.58,7.24 90 top
JP1  61.21,41.4 270 top
JP2  1.91,18.67 270 top
JP6  11.09,1.82 180 top
JP7  5.71,42.29 0 top
L1  40.61,40.38 0 top
LED1  53.09,1.15 270 top
LED2  23.09,2.54 270 top
LED3  38.28,1.78 270 top
Q1  34.74,2.29 270 top
R1  16.81,41.88 270 top
R2  23.01,14.53 90 top
R3  19.01,41.88 270 top
R4  21.21,41.88 270 top
R5  21.11,14.53 90 top
R6  44.28,27.08 270 top
R7  44.28,31.18 270 top
R8  34.51,17.03 180 top
R9  38.61,17.03 180 top
R10  26.31,14.28 180 top
R11  30.41,14.28 180 top
R12  44.28,35.28 270 top
R13  43.66,11.43 180 top
R14  54.64,3.67 90 top
R15  30.87,46.02 270 top
R16  28.61,45.89 270 top
R17  26.1,46.02 270 top
R18  34.41,46.08 90 top
R19  23.91,5.22 90 top
R20  38.28,3.56 180 top
R21  30.05,5.71 0 top
SJ1  18.74,14.73 270 bottom
SJ2  21.21,14.73 90 bottom
SJ3  31.15,43.05 0 top
SJ4  26.07,43 0 top
SJ6  28.57,2.16 0 top
U1  28.11,30.98 0 top
U2  19.05,46.1 270 top
U3  17.51,4.18 180 top
U4  40.51,46.48 90 top
U$31  [DRILL_0.1000]  61.98,2.16 0 top
U$32  [DRILL_0.1000]  61.98,47.5 0 top
U$33  [DRILL_0.1000]  2.16,2.16 0 top
U$34  [DRILL_0.1000]  2.29,47.5 0 top
U$35  [BIOHAZARD_10.00]  45.34,17.53 0 top
X1  9,30.98 270 top
X3  61.06,23.53 270 top
X4  4.7,10.03 0 top
Y1  51.1,3.9 90 top

### Tracks (layer width: path | path; a pad name or v marks a point on that pad's centre or on a via)
5.0V  (via drill 0.4)  (1 unrouted)
  Top 0.25: X1.18 6.61,34.98 v6.01,35.58
  Top 0.305: U2.8 24.13,48.01 24.13,44.32 24,44.2 24,42.8
  Top 0.406: v16.61,39.38 16.61,40.87 R1.2 R3.2 R4.2 21.3,40.87 23.33,42.9 C20.1 23.91,43.4
  Bottom 0.406: v6.01,35.58 4.61,35.58 4.36,36.08 4.36,37.78 4.4,39.47 3.64,39.51 | v16.61,39.38 15.62,39.41 15.12,39.34 14.84,39.36 14.67,39.48 14.64,39.51 3.64,39.51 | 3.64,39.51 JP7.1
24V  (via drill 0.4)
  Top 0.254: X3.2 57.78,32.78 57.03,33.53 v57.16,37.48
  Top 0.406: C17.1 53.11,40.28 v52.01,39.18 50.91,39.18 | 50.56,40.08 50.91,40.43 C18.1 50.91,39.18 | D2.C 47.91,39.53 D1.C 50.91,39.18
  Bottom 0.406: v57.16,37.48 56.81,37.48 55.11,39.18 v52.01,39.18
ACTIVE  (via drill 0.39, 0.4)
  Top 0.254: U1.8 25.61,21.63 v25.76,21.63 | X3.31 57.61,18.28 v57.13,18.31 | R21.1 29.04,5.76 v27.81,6.98 | v47.37,33.27 54.36,35.31 54.36,43.31 52.96,44.96 D3.C
  Bottom 0.254: 41.98,26.88 38.51,23.28 27.41,23.28 v25.76,21.63 25.76,16.03 22.91,13.18 22.91,8.97 24.89,6.98 v27.81,6.98 | 41.98,26.88 43.78,26.88 48.12,22.78 53.02,22.78 v57.13,18.31 | 41.98,26.88 42.11,31.95 43.43,33.27 46.23,33.27 46.8,33.21 47.05,33.21 47.24,33.27 v47.37,33.27
AGND  (via drill 0.4)
  Top 0.254: C24.2 52.83,9.65
  Top 0.406: 52.83,9.65 52.58,9.14 51.31,9.14 51.18,9.02 51.24,9.02 C25.2
  other vias: 45.02,2.16 58.8,6.31 50.06,1.17 58.8,7.58 39.5,6.44 52.58,3.9
  pour Top (isolate 0.203): 64.39,10.03 39.37,9.91 37.34,7.11 37.34,0 64.26,0
  pour Bottom (isolate 0.406): 64.39,9.91 47.5,9.91 45.08,7.62 37.34,7.62 37.34,0 64.26,-0.13
ASD
  Top 0.254: U1.46 38.11,34.98 39.11,35.98 41.51,35.98 42.61,34.88 R12.3
AVDD  (via drill 0.4)
  Top 0.25: U1.88 17.86,30.98 17.51,30.63 15.61,30.63 | 15.61,30.63 13.87,28.63 C11.1 13.61,26.48 13.41,26.28 12.31,26.28 12.01,25.98 v12.01,23.73 | 15.61,30.63 15.61,33.38 15.81,33.58 17.46,33.58 | U1.82 17.86,33.98 17.46,33.58 | U1.84 18.01,32.98 17.46,33.53 17.46,33.58 | U1.95 18.41,27.48 17.91,26.98 17.91,20.73 16.86,19.68 v15.71,18.53
  Top 0.254: v15.71,18.53 FB3.2 C9.1
  Bottom 0.25: v15.71,18.53 12.21,18.53 12.01,18.73 v12.01,23.73
AVDD2  (via drill 0.4)
  Top 0.406: v44.96,0.76 46.23,1.14 FB7.2 | v31.37,0.76 31.37,1.65 30.86,2.16 SJ6.2
  Bottom 1.016: v31.37,0.76 v44.96,0.76
B0
  Top 0.254: U1.10 26.61,17.18 25.01,15.58 R10.4
B1
  Top 0.254: U1.11 27.11,16.78 25.91,15.58 R10.3
B2
  Top 0.254: U1.12 27.61,16.38 26.71,15.48 R10.2
B3
  Top 0.254: U1.13 28.11,15.98 27.61,15.48 R10.1
B4
  Top 0.254: U1.14 28.61,16.08 29.11,15.58 R11.4
B5
  Top 0.254: U1.15 29.11,16.98 30.01,16.08 R11.3
B6
  Top 0.254: U1.16 29.61,17.78 30.81,16.58 R11.2
B7
  Top 0.254: U1.17 30.11,18.68 31.71,17.08 R11.1
CVB
  Top 0.254: U1.47 37.81,35.48 38.91,36.58 41.81,36.58 42.71,35.68 R12.2
D+
  Top 0.254: 10.77,9.67 12.41,9.68 22.61,9.68 33.27,6.48 35.17,4.96 IC1.19
  Top 0.305: X4.3 10.26,10.16 10.77,9.67
D-
  Top 0.254: IC1.18 35.41,5.61 33.65,6.98 22.81,10.28 11.44,10.28 10.89,10.32
  Top 0.305: X4.2 10.51,10.83 10.89,10.32
DISPEN  (via drill 0.4)
  Top 0.254: X3.34 61.81,16.78 62.91,17.88 62.91,23.68 v62.61,23.98 | R12.6 v47.09,34.88
  Bottom 0.254: v47.09,34.88 47.09,36.98 47.86,37.88 54.71,37.88 62.61,29.98 v62.61,23.98
G0
  Top 0.254: U1.20 31.61,21.03 33.21,19.43 R8.4
G1
  Top 0.254: U1.21 32.11,21.33 34.11,19.33 R8.3
G2
  Top 0.254: U1.22 32.61,21.63 34.91,19.33 R8.2
G3
  Top 0.254: U1.23 33.11,21.93 35.81,19.23 R8.1
G4
  Top 0.254: U1.24 33.61,22.23 37.31,18.53 R9.4
G5
  Top 0.254: U1.25 34.11,22.78 38.21,18.68 R9.3
G6
  Top 0.254: U1.26 35.86,22.13 39.01,18.98 R9.2
G7
  Top 0.254: U1.27 36.81,25.48 37.01,25.28 37.01,21.93 39.91,19.03 R9.1
GND  (via drill 0.4)  (2 unrouted)
  Top 0.203: 63.46,25.08 63.46,16.78 | X3.36 59.73,15.78 59.94,16
  Top 0.25: 41.23,25.84 C5.2 | U1.28 37.31,25.98 37.66,25.13 v37.78,24.11 | v5.26,34.48 X1.17 9.86,34.48 10.75,34.49 10.75,31.48 | U1.98 23.11,25.98 | 23.11,25.98 23.74,26.61 | U1.92 U1.P$14 | U1.87 23.61,31.48 U1.P$15 | U1.89 23.61,30.48 U1.P$15 | U1.83 23.61,33.48 U1.P$16 | U1.P$1 23.61,35.48 U1.79 18.36,35.48 | U1.76 20.36,39.22 C8.2 | U1.58 30.61,39.73 | U1.1 22.11,24.98 23.11,25.98 | 23.74,26.61 U1.P$13 | U1.5 24.11,26.23 23.74,26.61 | U1.P$15 U1.THERMAL | X1.5 6.61,28.48 6.36,28.23 6.36,26.98 | 6.36,26.98 6.36,26.08 v6.61,25.83 | X1.2 6.36,26.98 | X1.8 10.5,29.98 10.75,30.23 10.75,31.48 | 10.75,31.48 X1.11 | U1.19 31.11,20.93
  Top 0.254: U1.4 23.61,26.48 U1.P$13 | 31.11,20.93 31.11,20.33 32.26,19.3 32.17,19.22 v32.17,18.13 32.41,17.89 32.41,14.38 | U1.39 37.16,31.48 v37.36,32.63 | U1.45 38.59,34.48 39.11,35 C6.2 | v61.51,32.28 X3.3 57.77,32.28 | v21.71,21.78 22.11,22.18 U1.1 | 24.11,22.58 24.11,21.58 | 30.61,39.73 30.61,40.02 C7.2 | U1.68 25.61,40.32 C3.2 | X3.29 59.81,19.28 v60.11,19.58 | v62.12,15.77 63.46,16.53 63.46,16.78 | 2.37,23.73 2.5,24.78 | C16.1 36.76,46.33 36.61,46.48 35.71,46.48 | X3.36 57.75,15.78 57.4,16.13 57.4,17.02 56.39,17.02 | 20.71,12.53 20.71,11.23 v18.46,11.23
  Top 0.305: X1.P$2 8.24,25.1 | Q1.2 34.76,1.34 34.76,3.14 v35.05,3.43
  Top 0.4: C15.2 v37.91,22.38 | C5.2 v41.97,25.6 | C11.2 v13.87,23.73 | 8.24,25.1 v6.61,25.83 | v8.24,36.59 v8.25,36.58
  Top 0.406: X1.P$1 v8.24,36.59 | 2.42,39.43 2.42,37.03 | 1,38.23 3.41,38.23 | 1.74,24.83 2.5,24.78 | 1,23.73 2.37,23.73 | 8.25,24.55 7.61,23.73 9.71,23.73 | 20.71,12.53 20.71,13.52 R5.1 | 29.21,42.98 29.2,43 | C3.2 25.21,41.21 26.16,42.16 26.24,42.16 SJ4.2
  Top 0.61: 60.88,37.42 60.91,37.68 | 61.27,37.07 61.27,33.19
  Bottom 0.254: SJ2.1 21.21,12.83 22.35,12.83 22.35,11.18 18.41,11.18
  Bottom 0.4: 29.21,42.98 29.46,42.98 | v41.97,25.6 41.98,25.73 | v13.87,23.73 13.61,23.48 | v8.25,36.58 8.25,36.38 8.15,36.54
  Bottom 0.406: 2.42,39.46 2.42,37.01 | 3.36,38.23 1.26,38.23 | 8.25,38.59 8.37,37.01 | 5.61,38.23 9.66,38.23 | 1,23.73 3.46,23.73 | 8.25,25.06 8.25,22.91 | 6.76,23.73 9.66,23.73 | SJ2.1 19.94,13.72 19.94,13.97
  other vias: 20.26,37.83 41.31,34.88 11.61,16.86 17.76,16.98 56.45,17.05 19.81,5.78 24.76,16.68 40.51,46.48 54.6,34.44 1.47,40.26 18.16,36.18 28.56,40.33 16.56,11.23 13.24,12.06 14.71,17.03 23.71,12.08 13.01,8.63 19.12,47.3 5.84,45.14 32.6,44.73 32.55,48.11 19.81,8.68 6.14,1.77 4.35,15.81 46.14,37.58 57.1,41.51 37.51,37.48 27.18,5.71 25.27,7.87 33.66,8.38 16.25,4.89 61.14,15.02 12.61,47.48 28.48,43.54
  pour Bottom (isolate 0.254, rank 3): 64.37,-0.38 -0.13,-0.38 0,49.62 64.37,49.62
  pour Top (isolate 0.254, rank 2): 64.37,-0.25 0.13,-0.51 0,49.49 64.37,49.62
HSYNC  (via drill 0.4)
  Top 0.254: X3.32 61.21,17.78 61.81,18.38 61.81,19.28 59.76,21.33 59.76,27.53 v60.21,27.98 | R12.8 48.68,36.58 v49.11,36.16
  Bottom 0.254: v60.21,27.98 60.21,28.78 60.81,29.38 60.81,30.18 54.84,36.16 v49.11,36.16
LEDK  (via drill 0.4)
  Top 0.254: X3.1 58.42,33.28 58.31,33.52 v58.31,37.61
  Top 0.406: 44.2,47.18 C19.1 | U4.3 43.78,47.43 C19.1 | v32.36,46.68 32.08,46.94 | 32.08,46.94 28.61,46.94 | 28.61,46.94 26.89,46.94 R17.1 | R16.1 28.61,46.94 | R15.1 30.61,46.89 32.08,46.94 | v50.11,45.28 49.06,45.28 D2.A 47.31,47.03 | 47.31,47.03 47.24,47.1 | C19.1 47.31,47.03
  Bottom 0.406: 58.31,37.63 v58.31,37.61 58.31,37.88 57.66,38.53 56.86,38.53 v50.11,45.28 33.77,45.28 v32.36,46.68
N$1
  Top 0.25: X1.10 6.86,30.98 6.36,31.48 4.86,31.48 4.62,30.98 4.62,22.13 5.76,20.87 15.35,20.87 16.61,22.13 16.61,27.73 17.36,28.48 U1.93
N$2
  Top 0.25: X1.12 4.36,31.98 4.12,31.23 4.12,21.88 5.51,20.37 15.73,20.37 17.11,21.75 17.11,27.48 17.61,27.98 U1.94
N$3
  Top 0.25: U1.90 16.86,29.98 15.11,28.23 15.11,22.23 14.86,21.98 6.11,21.98 5.61,22.61 5.61,29.48 6.11,29.98 6.36,29.98 6.86,29.48 X1.7
N$4
  Top 0.25: X1.9 5.86,30.48 5.11,29.73 5.11,22.36 5.86,21.48 15.11,21.48 15.61,21.98 15.61,27.98 17.11,29.48 U1.91
N$5  (via drill 0.4)
  Top 0.25: X1.4 10.87,27.98 11.87,30 11.87,40.23 12,40.48 12.37,40.48 12.49,40.23 v12.49,32.73 | U1.85 16.86,32.48 v16.61,32.73
  Bottom 0.25: v16.61,32.73 v12.49,32.73
N$6  (via drill 0.4)
  Top 0.25: X1.6 10.75,28.98 11.25,30.25 11.25,40.61 11.62,40.98 12.87,40.98 13.25,40.48 13.25,33.83 13.21,31.58 13.21,31.45 v13.13,31.36 | U1.86 17.06,31.98 16.61,31.53 v16.61,31.48
  Bottom 0.25: v16.61,31.48 15.86,32.23 13.12,32.23 v13.13,31.36
N$7  (via drill 0.4)
  Top 0.25: X1.1 11.5,26.48 12.87,28.36 12.99,29.1 14.37,30.48 14.37,41.73 14.62,41.98 14.86,41.98 15.11,41.73 v15.11,35.73 | U1.80 17.25,34.98 17.11,35.12 v17.11,35.68
  Bottom 0.254: v15.11,35.73 15.46,35.38 16.81,35.38 v17.11,35.68
N$8  (via drill 0.4)
  Top 0.25: X1.3 11.62,27.48 12.37,28.61 12.37,29.35 13.87,30.85 13.87,41.98 14.37,42.48 15.11,42.48 15.61,41.98 15.61,36.68 16.11,36.18 16.11,35.48 v15.11,34.48 | v16.61,34.48 U1.81
  Bottom 0.254: v15.11,34.48 15.41,34.78 16.31,34.78 v16.61,34.48
N$9
  Top 0.25: X1.19 10.25,35.48 10.62,36.12 10.62,38.45
  Top 0.254: 10.62,38.45 10.62,40.91 11.88,43.05 15.88,43.05 16.8,42.9 R1.1
N$10
  Top 0.203: IC1.2 49.56,4.96 49.88,4.26 49.88,2.85 50.03,2.7 Y1.1
N$11
  Top 0.203: IC1.3 50.84,5.61 Y1.3
N$12
  Top 0.203: IC1.17 42,6.26 42.16,6.1 42.16,3.56 C4.1
N$13
  Top 0.254: 24.04,2.95 LED2.C 24.14,3.97 R19.1
N$14  (via drill 0.4)
  Top 0.254: v50.74,32.68 53.66,32.68 56.71,31.28 X3.5 | R6.5 v48.11,25.78
  Bottom 0.254: v48.11,25.78 47.42,25.78 46.51,26.69 46.51,29.33 47.81,30.63 50.06,30.63 50.71,32.56 v50.74,32.68
N$15  (via drill 0.4)
  Top 0.254: v51.57,31.86 53.98,31.87 54.98,31.48 56.31,30.78 X3.6 | R6.6 v49.01,26.68
  Bottom 0.254: v49.01,26.68 47.51,26.68 47.11,27.08 47.11,28.98 48.11,29.98 50.51,29.98 51.17,31.78 51.55,31.91 v51.57,31.86
N$16  (via drill 0.4)
  Top 0.254: v52.25,30.91 52.81,30.73 54.98,30.73 55.81,30.28 X3.7 | R6.7 48.06,27.48 v48.11,27.53
  Bottom 0.254: v48.11,27.53 48.11,27.48 48.01,27.48 48.01,28.68 48.61,29.28 51.26,29.28 v52.25,30.91
N$17  (via drill 0.4)
  Top 0.254: R6.8 v49.01,28.38 | X3.8 v60.01,29.78
  Bottom 0.254: v49.01,28.38 51.31,28.38 52.71,29.78 53.11,29.78 53.56,30.23 54.11,30.23 54.66,30.78 59.01,30.78 v60.01,29.78
N$18  (via drill 0.4)
  Top 0.254: v54.96,29.73 55.41,29.28 X3.9 | R7.5 48.91,29.88 49.81,28.98 v49.81,25.58
  Bottom 0.254: v49.81,25.58 50.71,24.68 53.36,24.68 54.96,26.28 v54.96,29.73
N$19  (via drill 0.4)
  Top 0.254: v53.91,29.18 54.31,28.78 X3.10 | R7.6 49.11,30.78 50.61,29.28 v50.61,27.48
  Bottom 0.254: v50.61,27.48 50.61,26.08 51.36,25.38 52.71,25.38 53.91,26.58 v53.91,29.18
N$20  (via drill 0.4)
  Top 0.254: v52.86,28.63 53.21,28.28 X3.11 | R7.7 49.41,31.58 51.41,29.58 v51.66,27.22
  Bottom 0.254: v51.66,27.22 51.93,27.6 52.61,27.64 v52.86,28.63
N$21
  Top 0.254: R7.8 49.61,32.48 52.01,30.08 52.14,28.18 52.41,27.78 X3.12
N$22  (via drill 0.4)
  Top 0.254: v42.59,24.68 50.18,24.68 52.78,27.28 X3.13 | R8.5 v33.21,14.98
  Bottom 0.254: v33.21,14.98 33.21,15.48 41.39,24.68 v42.59,24.68
N$23  (via drill 0.4)
  Top 0.254: v43.46,23.88 50.18,23.88 53.08,26.78 X3.14 | R8.6 34.06,16.18 v34.06,14.18
  Bottom 0.254: v34.06,14.18 34.06,15.28 41.64,23.88 v43.46,23.88
N$24  (via drill 0.4)
  Top 0.254: v42.59,23.08 50.18,23.08 53.38,26.28 X3.15 | R8.7 v34.91,14.98
  Bottom 0.254: v42.59,23.08 41.99,23.08 v34.91,14.98
N$25  (via drill 0.4)
  Top 0.254: v43.74,22.28 50.18,22.28 53.68,25.78 X3.16 | R8.8 35.81,15.88 36.01,15.68 v36.01,14.13
  Bottom 0.254: v36.01,14.13 36.01,14.93 42.34,22.28 v43.74,22.28
N$26  (via drill 0.4)
  Top 0.254: v42.86,21.48 50.18,21.48 53.98,25.28 X3.17 | R9.5 v37.31,14.98
  Bottom 0.254: v37.31,14.98 37.31,15.33 42.7,21.48 v42.86,21.48
N$27  (via drill 0.4)
  Top 0.254: v44.14,20.68 50.18,20.68 54.28,24.78 X3.18 | R9.6 38.16,16.13 v38.16,14.13
  Bottom 0.254: v38.16,14.13 38.16,15.33 42.88,20.68 v44.14,20.68
N$28  (via drill 0.4)
  Top 0.254: v43.27,19.88 50.18,19.88 54.58,24.28 X3.19 | R9.7 v39.01,14.98
  Bottom 0.254: v39.01,14.98 39.01,15.18 43.2,19.88 v43.27,19.88
N$29  (via drill 0.4)
  Top 0.254: v44.55,19.08 50.18,19.08 54.88,23.78 X3.20 | R9.8 39.91,14.13 v39.86,14.13
  Bottom 0.254: v44.55,19.08 43.3,19.08 39.86,15.13 v39.86,14.13
N$30  (via drill 0.4)
  Top 0.254: v43.7,18.28 50.18,18.28 55.18,23.28 X3.21 | R10.5 v25.01,12.18
  Bottom 0.254: v43.7,18.28 40.81,15.01 40.81,13.88 40.26,13.33 28.06,13.33 27.61,13.78 25.41,13.78 25.01,13.38 v25.01,12.18
N$31  (via drill 0.4)
  Top 0.254: v45.23,17.48 50.18,17.48 55.48,22.78 X3.22 | R10.6 25.86,13.38 v25.86,11.13
  Bottom 0.254: v25.86,11.13 25.86,12.83 26.21,13.18 27.21,13.18 27.56,12.83 40.66,12.83 43.91,17.48 v45.23,17.48
N$32  (via drill 0.4)
  Top 0.254: v44.36,16.68 50.18,16.68 55.78,22.28 X3.23 | R10.7 v26.71,12.18
  Bottom 0.254: v26.71,12.18 26.86,12.33 41.28,12.33 44.03,16.43 v44.36,16.68
N$33  (via drill 0.4)
  Top 0.254: v45.26,15.88 50.18,15.88 56.08,21.78 X3.24 | R10.8 27.56,13.38 v27.56,11.13
  Bottom 0.254: v27.56,11.13 28.26,11.83 41.75,11.83 44.45,15.88 v45.26,15.88
N$34  (via drill 0.4)
  Top 0.254: v46.16,15.08 50.18,15.08 56.38,21.28 X3.25 | R11.5 29.11,11.18 v28.86,10.93
  Bottom 0.254: v28.86,10.93 29.26,11.33 42.2,11.33 44.81,15.08 v46.16,15.08
N$35  (via drill 0.4)
  Top 0.254: v45.4,14.16 50.05,14.16 56.68,20.78 X3.26 | R11.6 30.01,10.68 v30.16,10.43
  Bottom 0.254: v30.16,10.43 30.56,10.83 42.7,10.83 45.01,14.16 v45.4,14.16
N$36  (via drill 0.4)
  Top 0.254: v46.3,13.36 50.05,13.36 56.85,20.28 X3.27 | R11.7 30.81,11.58 31.46,10.93 v31.46,9.83
  Bottom 0.254: v31.46,9.83 31.96,10.33 43.96,10.33 45.97,13.48 v46.3,13.36
N$38
  Top 0.25: U1.97 18.86,26.48 18.61,26.23 18.61,20.25 C10.1
  Top 0.254: FB4.2 16.79,16.27 16.79,17.43 16.79,18.06 C10.1
N$39  (via drill 0.4)
  Top 0.254: v47.08,12.56 50.05,12.56 57.02,19.78 X3.28 | R11.8 31.71,11.93 32.76,10.88 v32.76,9.23
  Bottom 0.254: v32.76,9.23 33.36,9.83 44.36,9.83 46.32,12.56 v47.08,12.56
N$40
  Top 0.203: IC1.11 41.76,11.43 R13.2
N$41
  Top 0.203: LED1.C 54.4,1.15 54.4,1.5 R14.1
N$42  (via drill 0.4)
  Top 0.25: 38.66,33.48 U1.43 34.61,33.48 | 19.36,35.98 U1.78 21.41,35.98 21.61,36.18 21.61,37.08 22.01,37.48 31.11,37.48 | 18.36,39.22 C8.1 | 34.61,33.48 34.61,37.18 34.31,37.48 31.11,37.48 | U1.57 31.11,37.48 | 34.61,33.48 34.61,26.48 U1.29 37.91,26.48 38.41,25.98 C5.1 FB2.2 39.31,24.15
  Top 0.254: v31.01,18.93 30.61,19.33 U1.18 30.61,24.28 30.81,24.48 34.31,24.48 34.61,24.78 34.61,26.48 | 38.66,33.48 39.39,33.48 C6.1 | U1.57 31.11,40.02 C7.1 | 19.36,35.98 19.11,36.23 19.11,38.47 C8.1
N$43
  Top 0.203: IC1.5 49.22,6.91 53.47,5.71 53.47,2.41 LED1.A
N$45
  Top 0.254: LED3.C 39.42,1.4 R20.1
N$46
  Top 0.254: Q1.3 R20.2
N$47
  Top 0.406: D1.A 42.41,39.18 L1.P$2 41.81,40.98 U4.1
N$48
  Top 0.203: R21.2 32.45,5.71 33.74,4.42 Q1.1
N$49
  Top 0.406: R15.2 30.87,44.47 SJ3.2
N$50
  Top 0.254: SJ4.1 25.05,44.35 25.53,44.83 25.87,44.83 R17.2
N$52  (via drill 0.39, 0.4)
  Top 0.254: v37.76,47.33 34.64,47.33 R18.2 | D3.A 50.76,47.5 v50.67,47.58
  Top 0.406: U4.4 37.86,47.43 v37.76,47.33
  Bottom 0.254: JP1.2 57.2,44.48 56.93,44.48 55.8,44.47 54.02,47.54 51.31,47.58 v50.67,47.58 38.01,47.58 v37.76,47.33
N$53
  Top 0.254: X3.39 57.84,14.28 57.53,13.97 FB5.2
N$54
  Top 0.254: X3.40 62.67,13.78 63.25,13.21 63.25,9.02 FB6.2
N$55
  Top 0.203: IC1.4 46.77,6.26 46.74,4.33 47.75,4.31 | 47.75,4.31 47.75,2.92 C1.2 | IC1.1 47.75,4.31
  Top 0.305: FB7.1 C1.2
N$56
  Top 0.254: X3.37 56.94,15.28 FB9.2
N$57
  Top 0.254: X3.38 57.58,14.78 FB10.2
OCK_INV  (via drill 0.4)
  Top 0.25: U1.100 21.36,24.98 21.61,24.73 21.61,23.23 v20.36,21.98
  Top 0.254: v21.21,17.68 21.21,15.65 R5.2
  Bottom 0.254: v20.36,21.98 20.36,21.53 21.21,20.68 v21.21,17.68 19.23,17.68 18.61,17.06 SJ1.1
PIXCLK  (via drill 0.4)
  Top 0.254: X3.30 v60.96,18.78 | R12.5 47.48,34.11 v48.3,34.44
  Bottom 0.254: v60.96,18.78 60.96,20.13 57.16,23.98 48.22,23.98 45.91,26.29 45.91,29.78 47.41,31.28 48.32,31.28 v48.3,34.44
R0
  Top 0.254: U1.30 41.56,26.98 42.89,26.04 R6.4
R1
  Top 0.254: U1.31 41.99,27.48 43.04,26.68 R6.3
R2
  Top 0.254: U1.32 42.54,27.98 43.17,27.61 R6.2
R3
  Top 0.254: U1.33 42.13,28.48 43.37,28.38 R6.1
R4
  Top 0.254: U1.34 42.08,28.98 42.98,29.76 R7.4
R5
  Top 0.254: U1.35 41.67,29.48 42.97,30.78 R7.3
R6
  Top 0.254: U1.36 41.31,29.98 42.91,31.58 R7.2
R7
  Top 0.254: U1.37 39.76,30.48 41.76,32.48 R7.1
SCL  (via drill 0.4)
  Top 0.25: X1.15 6.46,33.48 5.86,32.88 4.21,32.88
  Top 0.254: U2.6 19.51,45.53 19.01,45.03 v18.88,44.43 R3.1 | 4.21,32.88 3.66,33.43 3.66,35.78 4.96,36.83 4.96,38.78 5.38,40.21 6.65,40.34 7.21,40.4 7.21,41.63 7.14,42.44 6.97,42.32 JP7.3
  Bottom 0.254: JP7.3 7.08,40.75 12.19,40.75 12.19,44.45 v18.88,44.43
SDA  (via drill 0.4)
  Top 0.25: X1.16 6.11,33.98 5.61,33.48 4.46,33.48
  Top 0.254: U2.5 21.34,44.26 v20.45,44.31 R4.1 | 4.46,33.48 4.26,33.68 4.26,35.08 5.51,36.33 5.51,38.53 6.21,39.48 7.68,39.61 7.81,40.63 7.94,40.83 8.58,40.83 8.86,40.83 9.8,40.89 9.86,41.9 JP7.4
  Bottom 0.254: JP7.4 9.79,45.16 20.36,45.28 v20.45,44.31
ST  (via drill 0.4)
  Top 0.254: R2.2 22.81,16 v22.81,17.68 | U1.3 23.11,21.13 v22.71,20.73
  Bottom 0.254: v22.71,20.73 22.71,17.78 v22.81,17.68 22.81,16.08 22.48,15.75 SJ2.2
VDD  (via drill 0.4)
  Top 0.203: v32.26,3.43 32.77,2.92 32.77,0.76 32.89,0.64 37.36,0.64 LED3.A
  Top 0.254: 59.91,31.78 X3.4 | C15.1 FB2.1 | U3.4 21.97,1.13 | 21.97,1.13 26.79,1.13 SJ6.1 C23.1 | LED2.A 21.97,2.47 21.97,1.13
  Top 0.305: 61.31,30.38 59.91,31.78
  Top 0.4: 41.31,24.12 FB2.1
  Top 0.406: C14.1 20.93,4.18 17.51,4.18
  Top 0.61: v60.56,26.73 61.31,27.48 61.31,30.38 | C15.1 41.33,19.92 42.01,19.23 42.01,13.47 39.71,11.18 38.86,11.18 36.13,8.48 v35.31,8.48 | v17.51,12.08 FB4.1 | FB3.1 FB4.1 | FB4.1 FB1.1 | JP6.1 13.25,1.13 U3.4
  Top 0.813: U3.4 17.51,4.18 v17.51,5.73 U3.2
  Bottom 0.254: 17.51,5.68 v17.51,5.73
  Bottom 0.61: v60.56,26.73 60.41,26.58 60.41,22.18 62.11,20.48 62.11,18.38 58.54,14.81 55.2,14.81 51.43,11.05 47.55,11.05 44.86,8.48 v35.31,8.48 32.26,5.43 v32.26,3.43 32.11,3.28 19.91,3.28 17.51,5.68 | v17.51,12.08 v17.51,5.73
VDDIO  (via drill 0.4)
  Top 0.203: FB1.2 19.86,15.55 19.86,14.94 20.26,14.53 22.05,14.53 22.5,14.08 22.5,13.52 R2.1 22.48,13.52 22.48,12.95 v21.59,12.06
  Top 0.25: U1.99 19.36,25.48 19.11,25.23 19.11,21.86 20.36,20.61 20.36,18.88 | U1.6 24.61,22.28 24.91,21.98 25.11,22.18 U1.7
  Top 0.254: U1.38 37.61,30.98 v38.56,31.93 | 24.91,21.98 24.91,20 C2.1 | 19.31,15.43 FB1.2 19.81,16.05 19.81,16.28 20.36,16.83 20.36,18.88 20.41,18.88 | U1.67 26.11,39.72 C3.1
  Top 0.406: C2.1 25.23,20 v23.98,18.88 20.41,18.88 | C3.1 27.41,40.78 v28.71,42.08
  Bottom 0.254: SJ1.2 18.61,13.59 19.18,13.59 19.18,12.42 19.54,12.06 v21.59,12.06
  Bottom 0.406: v28.71,42.08 30.01,40.78 37.46,40.78 38.56,39.68 v38.56,31.93 31.61,24.98 25.61,24.98 23.98,23.36 v23.98,18.88
VIN  (via drill 0.4)
  Top 0.254: 34.41,45.38 R18.1 v34.41,43.58 | v9.93,16.25 9.88,14.35 C12.1
  Top 0.305: 9.86,15.04 v9.93,16.25
  Top 0.406: 9.9,15.34 v9.93,16.25 | v38.81,43.58 L1.P$1 38.81,38.68 v36.81,38.68 | v38.81,43.58 38.81,45.53 U4.5 | v15.21,5.73 14.75,5.27 C13.1 | C16.2 37.18,43.58 v38.81,43.58 | C26.+ 8.78,16.22 v9.93,16.25 | X4.1 7.75,11.63 9.65,11.68 9.91,11.94 9.91,15.24 9.93,15.24 v9.93,16.25
  Top 0.813: v15.21,5.73 U3.3
  Bottom 0.254: v34.41,43.58 v38.81,43.58
  Bottom 0.406: v36.81,38.68 34.06,35.93 31.66,35.93 31.11,35.38 31.11,33.98 25.11,27.98 23.61,27.98 18.86,23.23 18.86,19.43 15.21,15.78 15.21,15.23 | 15.21,15.23 v15.21,5.73 | 15.21,15.23 v9.93,16.25 6.35,17.8 6.35,19.56 4.06,21.84 3.05,21.84 JP2.1
VSYNC  (via drill 0.4)
  Top 0.254: X3.33 61.51,17.28 62.36,18.13 62.36,21.38 61.41,22.33 v61.41,25.78 | R12.7 v48.06,35.68
  Bottom 0.254: v48.06,35.68 48.06,37.25 50.13,37.28 54.51,37.28 61.51,30.38 61.51,26.28 61.41,26.18 v61.41,25.78
X+  (via drill 0.4)
  Top 0.203: v50.67,7.45 49.78,8.13 48.29,8.13 arc45 IC1.7
  Top 0.254: FB9.1 53.85,15.62 50.29,12.06 C25.1 50.93,11.05 49.4,10.67 49.4,8.21 v50.67,7.45
  Bottom 0.203: 54.99,8.76 53.68,7.45 v50.67,7.45
X-  (via drill 0.39)
  Top 0.203: IC1.14 43.94,8.21 44.58,8.98 44.58,11.2 R13.1
  Top 0.254: C21.1 FB5.1 55.5,11.3 v54.23,11.05 | R13.1 44.68,8.53 v45.85,7.49
  Bottom 0.254: v45.85,7.49 48.26,7.49 50.16,9.4 52.32,9.4 v54.23,11.05
XCV
  Top 0.254: U1.48 37.51,35.98 38.71,37.18 42.11,37.18 42.71,36.58 R12.1
Y+  (via drill 0.39, 0.4)
  Top 0.203: IC1.15 43.69,7.56 v43.69,6.29
  Top 0.254: C24.1 53.09,12.7 53.85,13.46 FB10.1 | 54.61,13.46 FB10.1 | v54.23,12.19 FB10.1
  Bottom 0.203: 55.88,11.18 53.59,8.64 50.55,8.64 48.2,6.29 v43.69,6.29
  Bottom 0.254: 55.88,11.18 v54.23,12.19
Y-  (via drill 0.4)
  Top 0.203: IC1.16 41.98,6.91 v44.07,4.83
  Top 0.254: FB6.1 57.28,5.33 | v56.77,5.33 57.28,5.33 | 57.28,5.33 C22.1
  Bottom 0.203: v44.07,4.83 55.24,4.83 55.24,5.33 v56.77,5.33
ZXC
  Top 0.254: U1.44 R12.4

### Text on the board
tPlace: +5V | GND | SCL | SDA | GND | BKL | TFP401 | HDMI | 40 pin TTL LCD | 5V | GND | HDMI to 40 pin TTL adapter | GND | +3V3
bPlace: +5V | GND | SCL | SDA | Backlite / Jumpers | +25mA | +100mA | GND | BKL | 5V | OCK_INV | GND | ST | GND | +3V3